# Altium project BW1097_R2M2E3.PrjPcb (part 7 of 10)

## Sheet BW1097_LEFT_OV9282.SchDoc: =project_title
size Tabloid; PageSetup: Record=PageOptions|CenterHorizontal=True|CenterVertical=True|PrintScale=0.71|XCorrection=1.00|YCorrection=1.00|PrintKind=0|BorderSize=5000000|LeftOffset=0|BottomOffset=0|Orientation=2|PaperLength=1000|PaperWidth=1000|Scale=100|PaperSource=7|PrintQuality=-4|MediaType=1|DitherType=10|PrintScaleMode=1|PaperKind=A4; CompanyName: Luxonis Holding; DrawnBy: Brian Weinstein; Organization: Luxonis Holding; Address1: 1925 Harmony Park Drive; Address2: Westminster, CO; Address3: 80234; Address4: United States; DocumentNumber: D0000196; Revision: R2M2E3; SheetNumber: 5; SheetTotal: 17
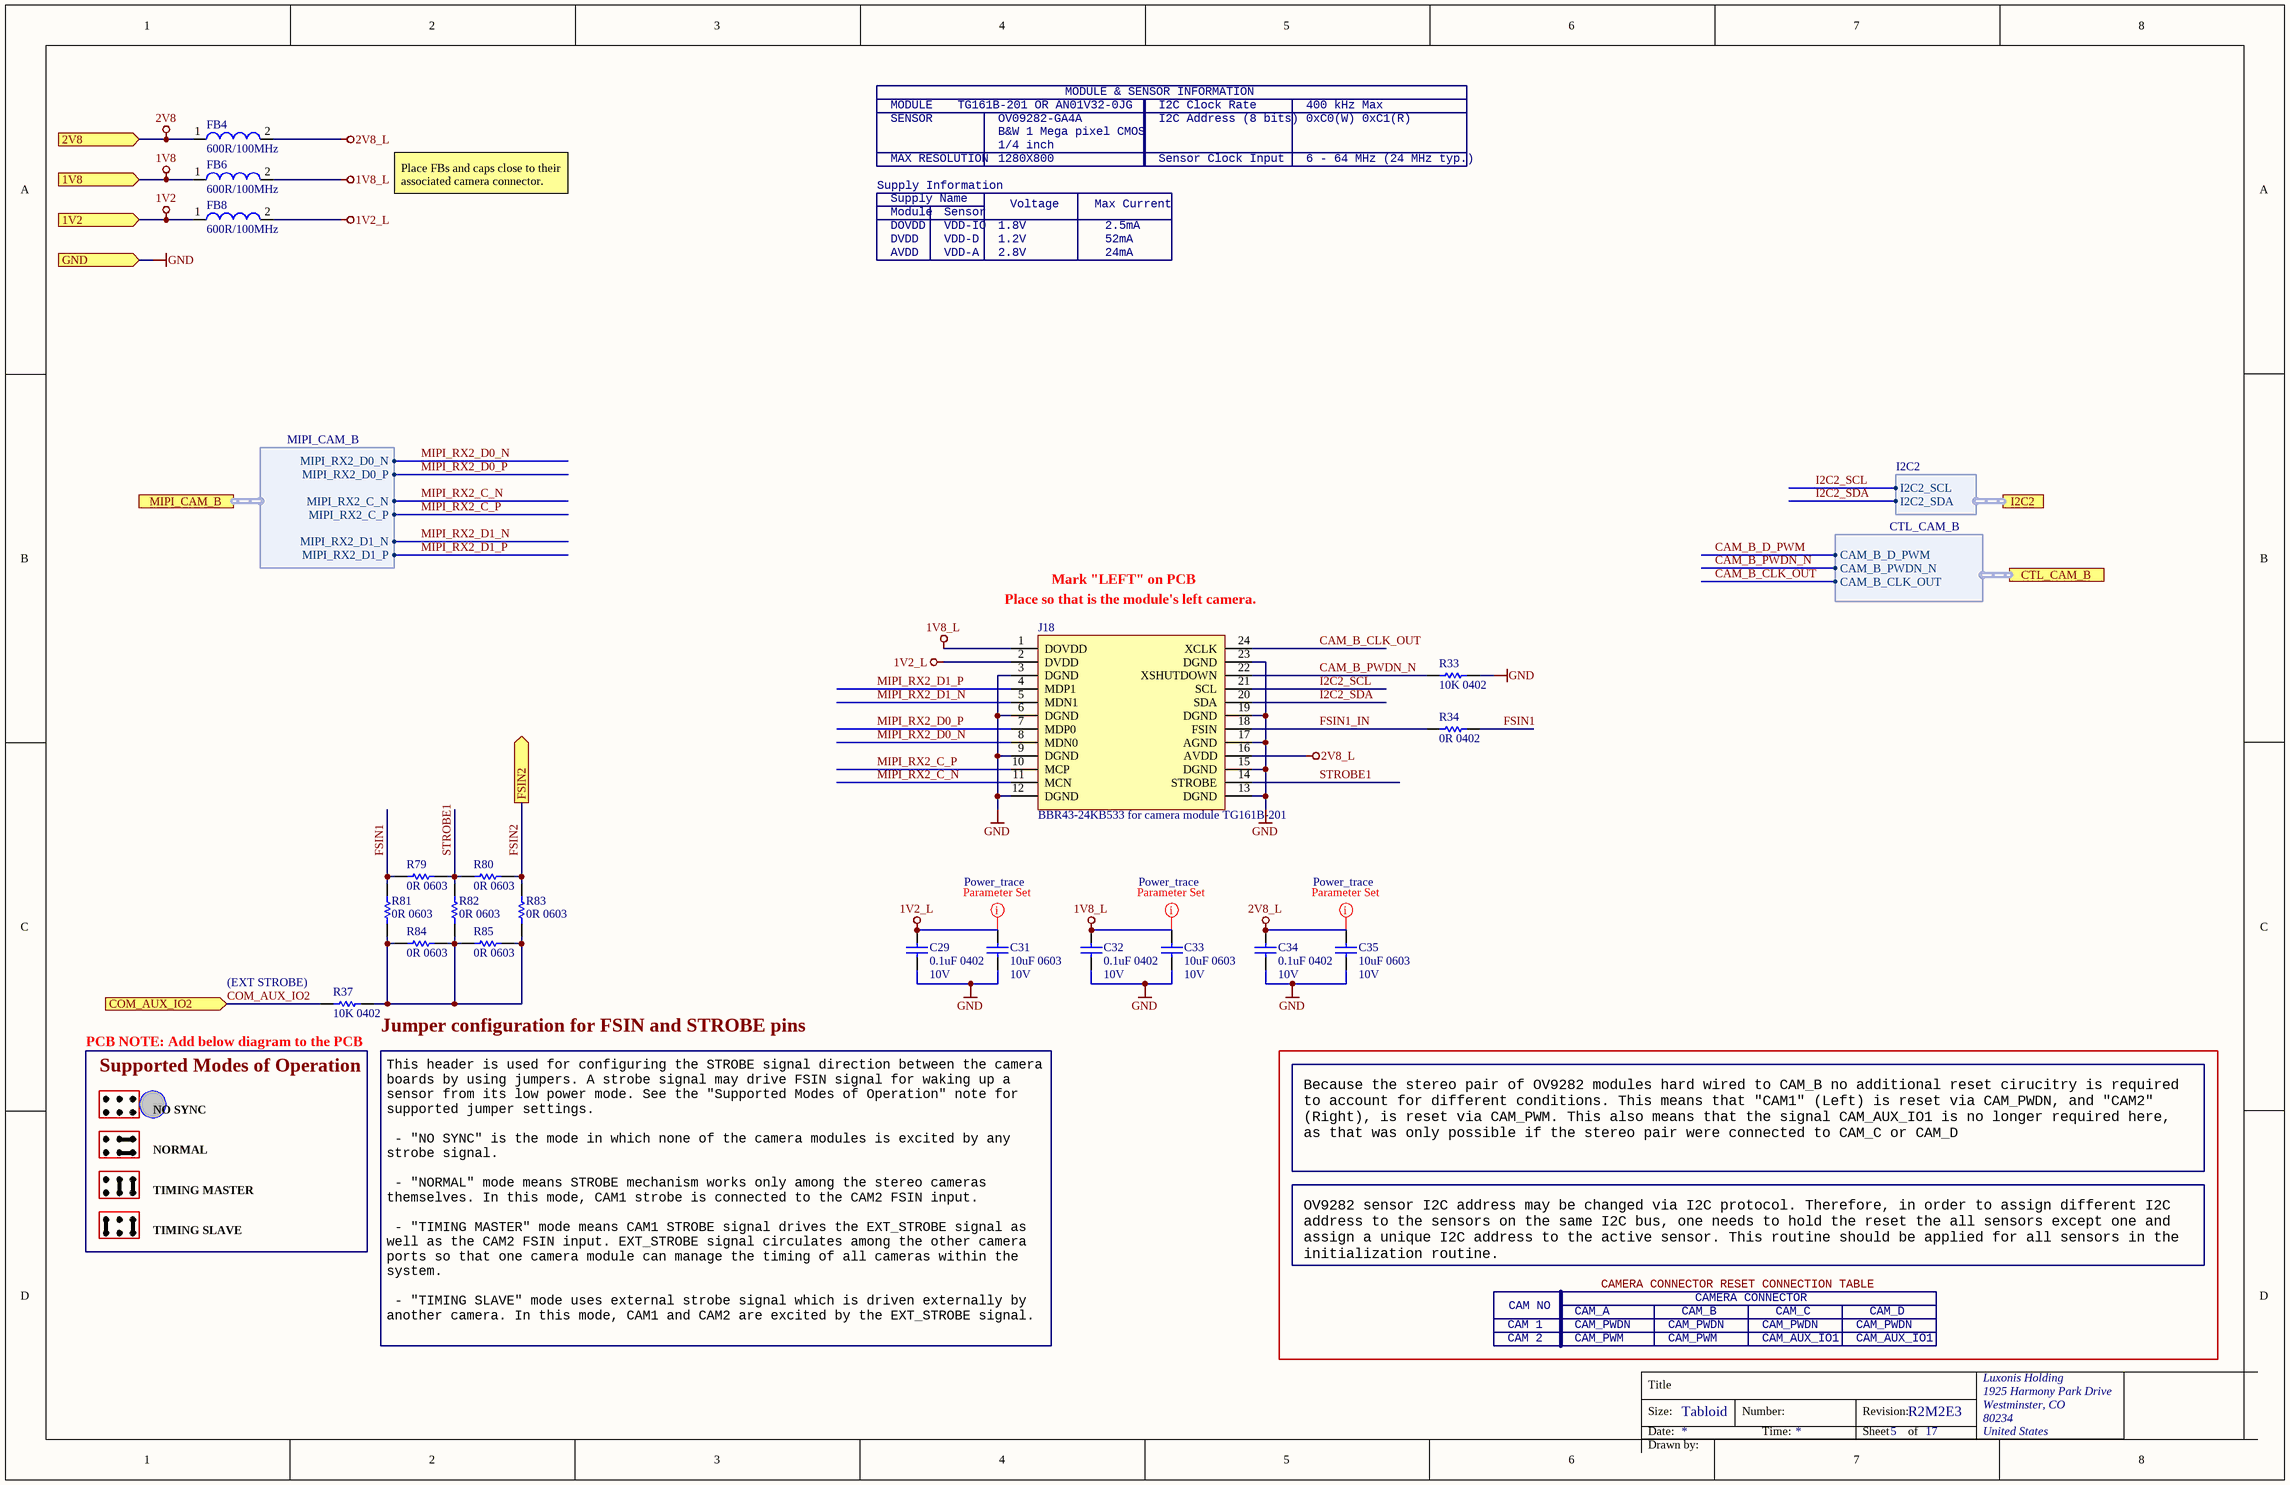
[diagram p10: BW1097_LEFT_OV9282.SchDoc]

### Parts
C29  0.1uF 0402  Voltage Rating: 10V  [CAPC0402(1005)70_N]
C31  10uF 0603  Voltage Rating: 10V  [CAPC0603(1608)100_N]
C32  0.1uF 0402  Voltage Rating: 10V  [CAPC0402(1005)70_N]
C33  10uF 0603  Voltage Rating: 10V  [CAPC0603(1608)100_N]
C34  0.1uF 0402  Voltage Rating: 10V  [CAPC0402(1005)70_N]
C35  10uF 0603  Voltage Rating: 10V  [CAPC0603(1608)100_N]
FB4  600R/100MHz  [2508056017Y2]
FB6  600R/100MHz  [2508056017Y2]
FB8  600R/100MHz  [2508056017Y2]
J18  BBR43-24KB533 for camera module TG161B-201  [TG161B-201_HD]
R33  10K 0402  [RESC0402(1005)_N]
R34  0R 0402  [RESC0402(1005)_N]
R37  10K 0402  [RESC0402(1005)_N]
R79  0R 0603  [RESC0603(1608)_N]
R80  0R 0603  [RESC0603(1608)_N]
R81  0R 0603  [RESC0603(1608)_N]
R82  0R 0603  [RESC0603(1608)_N]
R83  0R 0603  [RESC0603(1608)_N]
R84  0R 0603  [RESC0603(1608)_N]
R85  0R 0603  [RESC0603(1608)_N]

### Ports
1V2 (in), 1V8 (in), 2V8 (in), COM_AUX_IO2 (in), CTL_CAM_B (harness CTL_CAM_B), FSIN2 (out), GND (in), I2C2 (harness I2C2), MIPI_CAM_B (harness MIPI_CAM_B)

### Harnesses
I2C2: I2C2_SDA, I2C2_SCL
MIPI_CAM_B: MIPI_RX2_D1_P, MIPI_RX2_D1_N, MIPI_RX2_D0_N, MIPI_RX2_D0_P, MIPI_RX2_C_N, MIPI_RX2_C_P
CTL_CAM_B: CAM_B_CLK_OUT, CAM_B_PWDN_N, CAM_B_D_PWM

### Nets
1V2: FB8.1 ; port 1V2
1V2_L: C29.2 C31.2 FB8.2 J18.2(DVDD)
1V8: FB6.1 ; port 1V8
1V8_L: C32.2 C33.2 FB6.2 J18.1(DOVDD)
2V8: FB4.1 ; port 2V8
2V8_L: C34.2 C35.2 FB4.2 J18.16(AVDD)
GND: C29.1 C31.1 C32.1 C33.1 C34.1 C35.1 J18.3(DGND) J18.6(DGND) J18.9(DGND) J18.12(DGND) J18.13(DGND) J18.15(DGND) J18.17(AGND) J18.19(DGND) J18.23(DGND) R33.2 ; port GND
CAM_B_CLK_OUT: J18.24(XCLK) ; port CTL_CAM_B.CAM_B_CLK_OUT
CAM_B_PWDN_N: J18.22(XSHUTDOWN) R33.1 ; port CTL_CAM_B.CAM_B_PWDN_N
COM_AUX_IO2: R37.1 ; port COM_AUX_IO2
FSIN1: R34.2 R79.1 R81.2
FSIN1_IN: J18.18(FSIN) R34.1
FSIN2: R80.2 R83.2 ; port FSIN2
I2C2_SCL: J18.21(SCL) ; port I2C2.I2C2_SCL
I2C2_SDA: J18.20(SDA) ; port I2C2.I2C2_SDA
MIPI_RX2_C_N: J18.11(MCN) ; port MIPI_CAM_B.MIPI_RX2_C_N
MIPI_RX2_C_P: J18.10(MCP) ; port MIPI_CAM_B.MIPI_RX2_C_P
MIPI_RX2_D0_N: J18.8(MDN0) ; port MIPI_CAM_B.MIPI_RX2_D0_N
MIPI_RX2_D0_P: J18.7(MDP0) ; port MIPI_CAM_B.MIPI_RX2_D0_P
MIPI_RX2_D1_N: J18.5(MDN1) ; port MIPI_CAM_B.MIPI_RX2_D1_N
MIPI_RX2_D1_P: J18.4(MDP1) ; port MIPI_CAM_B.MIPI_RX2_D1_P
STROBE1: J18.14(STROBE) R79.2 R80.1 R82.2
NetR37_2: R37.2 R81.1 R82.1 R83.1 R84.1 R84.2 R85.1 R85.2

### Layout directives
net class Power_trace: 1V2_L, 1V8_L, 2V8_L

### Notes on the sheet
- MODULE & SENSOR INFORMATION
- SENSOR
- MODULE
- MAX RESOLUTION
- TG161B-201 OR AN01V32-0JG
- B&W 1 Mega pixel CMOS
- 1280X800
- OV09282-GA4A
- 1/4 inch
- I2C Address (8 bits)
- I2C Clock Rate
- Sensor Clock Input
- 400 kHz Max
- 6 - 64 MHz (24 MHz typ.)
- 0xC0(W) 0xC1(R)
- Place FBs and caps close to their associated camera connector.
- Supply Information
- DOVDD
- Supply Name
- Module
- VDD-IO
- Sensor
- 1.8V
- Voltage
- Max Current
- 2.5mA
- AVDD
- DVDD
- VDD-A
- VDD-D
- 2.8V
- 1.2V
- 24mA
- 52mA
- (near J18) Place so that is the module's left camera.
- Mark "LEFT" on PCB
- (near R37) (EXT STROBE)
- (near R37) Jumper configuration for FSIN and STROBE pins
- (near R37) PCB NOTE: Add below diagram to the PCB
- (near R37) Supported Modes of Operation
- NO SYNC
- NORMAL
- Because the stereo pair of OV9282 modules hard wired to CAM_B no additional reset cirucitry is required to account for different conditions. This means that "CAM1" (Left) is reset via CAM_PWDN, and "CAM2" (Right), is reset via CAM_PWM. This also means that the signal CAM_AUX_IO1 is no longer required here, as that was only possible if the stereo pair were connected to CAM_C or CAM_D
- TIMING MASTER
- TIMING SLAVE
- OV9282 sensor I2C address may be changed via I2C protocol. Therefore, in order to assign different I2C address to the sensors on the same I2C bus, one needs to hold the reset the all sensors except one and assign a unique I2C address to the active sensor. This routine should be applied for all sensors in the initialization routine.
- CAMERA CONNECTOR RESET CONNECTION TABLE
- CAMERA CONNECTOR
- (near R37) This header is used for configuring the STROBE signal direction between the camera boards by using jumpers. A strobe signal may drive FSIN signal for waking up a sensor from its low power mode. See the "Supported Modes of Operation" note for supported jumper settings.
  - "NO SYNC" is the mode in which none of the camera modules is excited by any strobe signal.
  - "NORMAL" mode means STROBE mechanism works only among the stereo cameras themselves. In this mode, CAM1 strobe is connected to the CAM2 FSIN input.
  - "TIMING MASTER" mode means CAM1 STROBE signal drives the EXT_STROBE signal as well as the CAM2 FSIN input. EXT_STROBE signal circulates among the other camera ports so that one camera module can manage the timing of all cameras within the system.
  - "TIMING SLAVE" mode uses external strobe signal which is driven externally by another camera. In this mode, CAM1 and CAM2 are excited by the EXT_STROBE signal.
  Note that, at most only one camera can be in the "TIMING MASTER" mode at a time. STROBE generation and FSIN reception should be configured via software.
- CAM 1
- CAM 2
- CAM NO
- CAM_A
- CAM_PWDN
- CAM_PWM
- CAM_B
- CAM_AUX_IO1
- CAM_C
- CAM_D
- Title
- Size:
- Date:
- Tabloid
- Number:
- Time:
- Revision:
- Sheet
- of
- Drawn by:

### Library data of the parts
C29 C32 C34 = GRM155R71A104JA01D: as C56 on sheet BW1097_HUB; Manufacturer Part Number 1: GRM155R71A104JA01D; Supplier 1: Digi-Key; Stock 1: 1346709; Pricing 1: 1=0.10000, 10=0.02500, 100=0.01130, 500=0.00806, 1000=0.00633, 2500=0.00575, 5000=0.00529 (USD); RoHS: Yes; Mount: Surface Mount; Case/Package: 0402; Case Code (Imperial): 0402; Case Code (Metric): 1005; Min Operating Temperature: -55°C; Max Operating Temperature: 125°C; Tolerance: 5%; Packaging: Tape and Reel; Voltage Rating (DC): 10V; Dielectric: X7R; Package Quantity: 10000; Termination: SMD/SMT; Length: 1mm; Height: 0.5mm; Width: 0.02inch; Thickness: 0.022inch; Depth: 0.5mm; Radiation Hardening: No; Lead Free: Lead Free; ComponentLink1URL: https://datasheet.ciiva.com/5411/product-5411135.pdf?src-supplier=Mouser; ComponentLink1Description: https://datasheet.ciiva.com/5411/product-5411135.pdf?src-supplier=Mouser; ComponentLink2URL: https://datasheet.ciiva.com/11618/c02e-11618821.pdf?src-supplier=Avnet; ComponentLink2Description: https://datasheet.ciiva.com/11618/c02e-11618821.pdf?src-supplier=Avnet; Supplier Part Number 1: 490-10777-1-ND
C31 C33 C35 = GRM188R61A106ME69D: as C77 on sheet BW1097_HUB; Manufacturer Part Number 1: GRM188R61A106ME69D; Supplier 1: Digi-Key; Stock 1: 2873098; Pricing 1: 1=0.21000, 10=0.14100, 100=0.07130, 500=0.04876, 1000=0.04313 (USD); RoHS: Yes; Mount: Surface Mount; Case/Package: 0603; Weight: 0.000222oz; Case Code (Metric): 1608; Case Code (Imperial): 0603; Min Operating Temperature: -55°C; Max Operating Temperature: 85°C; Packaging: Tape and Reel; Tolerance: 20%; Capacitance: 10uF; Dielectric: X5R; Voltage Rating (DC): 10V; Package Quantity: 4000; Termination: SMD/SMT; Length: 1.6mm; Height: 0.8mm; Width: 0.8mm; Thickness: 0.035inch; Depth: 0.8mm; REACH SVHC: Unknown; Lead Free: Lead Free; ComponentLink1URL: http://www.mouser.com/ds/2/281/c02e-2905.pdf?src-supplier=Mouser; ComponentLink1Description: http://www.mouser.com/ds/2/281/c02e-2905.pdf?src-supplier=Mouser; ComponentLink2URL: http://components.arrow.com/part/dataview/0323_06119472?src-supplier=Arrow+Europe; ComponentLink2Description: http://components.arrow.com/part/dataview/0323_06119472?src-supplier=Arrow+Europe; ComponentLink3URL: http://www.farnell.com/datasheets/2048014.pdf?src-supplier=Farnell; ComponentLink3Description: http://www.farnell.com/datasheets/2048014.pdf?src-supplier=Farnell; ComponentLink4URL: http://www.farnell.com/datasheets/1872210.pdf?src-supplier=Farnell; ComponentLink4Description: http://www.farnell.com/datasheets/1872210.pdf?src-supplier=Farnell; ComponentLink5URL: http://search.murata.co.jp/Ceramy/image/img/A01X/G101/ENG/GRM188R61A106ME69-01.pdf?src-supplier=Digi-Key; ComponentLink5Description: http://search.murata.co.jp/Ceramy/image/img/A01X/G101/ENG/GRM188R61A106ME69-01.pdf?src-supplier=Digi-Key; ComponentLink6URL: http://www.farnell.com/datasheets/1872210.pdf?src-supplier=Newark; ComponentLink6Description: http://www.farnell.com/datasheets/1872210.pdf?src-supplier=Newark; ComponentLink7URL: http://www.farnell.com/datasheets/2048014.pdf?src-supplier=Element14; ComponentLink7Description: http://www.farnell.com/datasheets/2048014.pdf?src-supplier=Element14; ComponentLink8URL: http://www.farnell.com/datasheets/2048014.pdf?src-supplier=Newark; ComponentLink8Description: http://www.farnell.com/datasheets/2048014.pdf?src-supplier=Newark; Supplier Part Number 1: 490-10475-1-ND
FB4 FB6 FB8 = 2508056017Y2: FERRITE BEAD, 0.1OHM, 2A, 0805, 600R/100MHz; Manufacturer 1: Fair-Rite; Impedance: 600R; Tolerance: 25%; Resistance: 350mR; DC Resistance (DCR): 100mR; Test Frequency: 100MHz; Manufacturer Part Number 1: 2508056017Y2; Supplier 1: Digi-Key; Stock 1: 100491; Pricing 1: 1=0.10000, 10=0.07900, 25=0.07120, 50=0.05240, 100=0.04520, 250=0.03568, 500=0.03014, 1000=0.02538 (USD); RoHS: Yes; Case/Package: 0805; Number of Pins: 2; Case Code (Metric): 2012; Case Code (Imperial): 0805; Min Operating Temperature: -55°C; Max Operating Temperature: 125°C; Package Quantity: 4000; Packaging: Tape and Reel; Max DC Current: 2A; Termination: SMD/SMT; Military Standard: Not; DC Current: 2A; Current Rating: 2A; Frequency: 100MHz; Length: 2mm; Height: 0.9mm; Width: 1.25mm; Depth: 1.25mm; Radiation Hardening: No; REACH SVHC: No SVHC; ComponentLink1URL: https://datasheet.ciiva.com/3854/3802508056017y2-3854245.pdf?src-supplier=Arrow; ComponentLink1Description: https://datasheet.ciiva.com/3854/3802508056017y2-3854245.pdf?src-supplier=Arrow; ComponentLink2URL: https://datasheet.ciiva.com/22735/652149-22735047.pdf?src-supplier=Element14; ComponentLink2Description: https://datasheet.ciiva.com/22735/652149-22735047.pdf?src-supplier=Element14; ComponentLink3URL: https://datasheet.ciiva.com/1127/26143-1127514.pdf?src-supplier=Farnell; ComponentLink3Description: https://datasheet.ciiva.com/1127/26143-1127514.pdf?src-supplier=Farnell; ComponentLink4URL: https://datasheet.ciiva.com/18090/getdatasheetpartid-212640-18090187.pdf?src-supplier=Verical; ComponentLink4Description: https://datasheet.ciiva.com/18090/getdatasheetpartid-212640-18090187.pdf?src-supplier=Verical; ComponentLink5URL: https://datasheet.ciiva.com/7620/26143-7620140.pdf?src-supplier=Element14; ComponentLink5Description: https://datasheet.ciiva.com/7620/26143-7620140.pdf?src-supplier=Element14; Supplier Part Number 1: 1934-1487-1-ND
J18 = TG161B-201_Connector: CONN 24 way, 2 row board to board connector SMD; Manufacturer: ACON; Manufacturer PN: BBR43-24KB533
R33 R37 = RC0402FR-1310KL: as R40 on sheet BW1097_HUB; Manufacturer Part Number 1: RC0402FR-1310KL; ComponentLink1URL: https://datasheet.ciiva.com/16940/pyu-rc0402-51-rohs-l-6-16940293.pdf?src-supplier=Avnet+Europe; ComponentLink1Description: https://datasheet.ciiva.com/16940/pyu-rc0402-51-rohs-l-6-16940293.pdf?src-supplier=Avnet+Europe; ComponentLink2URL: https://datasheet.ciiva.com/28386/pyu-rc0402-51-rohs-l-6-28386855.pdf?src-supplier=Avnet+Europe; ComponentLink2Description: https://datasheet.ciiva.com/28386/pyu-rc0402-51-rohs-l-6-28386855.pdf?src-supplier=Avnet+Europe; ComponentLink3URL: https://datasheet.ciiva.com/16740/pyu-rc0402-51-rohs-l-6-r-16740602.pdf?src-supplier=Future+Electronics; ComponentLink3Description: https://datasheet.ciiva.com/16740/pyu-rc0402-51-rohs-l-6-r-16740602.pdf?src-supplier=Future+Electronics; ComponentLink4URL: https://datasheet.ciiva.com/8891/pyu-rc0402-51-rohs-l-6-8891339.pdf?src-supplier=Avnet; ComponentLink4Description: https://datasheet.ciiva.com/8891/pyu-rc0402-51-rohs-l-6-8891339.pdf?src-supplier=Avnet; ComponentLink5URL: https://datasheet.ciiva.com/5557/pyu-rc0402-51-rohs-l-6-r-5557997.pdf?src-supplier=Mouser; ComponentLink5Description: https://datasheet.ciiva.com/5557/pyu-rc0402-51-rohs-l-6-r-5557997.pdf?src-supplier=Mouser; ComponentLink6URL: https://datasheet.ciiva.com/7983/1018594-7983533.pdf?src-supplier=Element14; ComponentLink6Description: https://datasheet.ciiva.com/7983/1018594-7983533.pdf?src-supplier=Element14; Supplier 1: Newark; Stock 1: 62239; Pricing 1: 1=0.10000, 25=0.01200, 100=0.00400, 250=0.00400, 500=0.00300, 1000=0.00300 (USD); RoHS: Yes; Case/Package: 0402; Number of Pins: 2; Contact Plating: Tin,Matte,Lead; Case Code (Imperial): 0402; Case Code (Metric): 1005; Min Operating Temperature: -55°C; Max Operating Temperature: 155°C; Tolerance: 1%; Composition: Thick Film; Packaging: Tape and Reel; Termination: SMD/SMT; Military Standard: Not; Voltage Rating (DC): 50V; Working Voltage: 50V; Number of Terminations: 2; Length: 1mm; Depth: 0.5mm; Radiation Hardening: No; REACH SVHC: No SVHC; Lead Free: Lead Free; Supplier Part Number 1: 67R9960; Supplier 2: Future Electronics; Supplier 3: Mouser; Supplier 4: Element14; Supplier Part Number 2: RC0402FR-1310KL-CUTT; Supplier Part Number 3: 603-RC0402FR-1310KL; Supplier Part Number 4: 1799235
R34 = CRCW04020000Z0ED: as R41 on sheet BW1097_HUB; Manufacturer Part Number 1: CRCW04020000Z0ED; Supplier 1: Digi-Key; Stock 1: 855968; Pricing 1: 1=0.10000, 10=0.03400, 25=0.02440, 50=0.01860, 100=0.01380, 250=0.01048, 500=0.00840, 1000=0.00618, 5000=0.00443 (USD); RoHS: Yes; Mount: Surface Mount; Case/Package: 0402; Weight: 2.3E-05oz; Case Code (Imperial): 0402; Case Code (Metric): 1005; Contact Plating: Tin; Min Operating Temperature: -55°C; Max Operating Temperature: 155°C; Packaging: Tape and Reel; Composition: Thick Film; Voltage Rating (DC): 50V; Package Quantity: 1; Termination: SMD/SMT; Number of Terminations: 2; Military Standard: Not; Max Power Dissipation: 63mW; Features: Automotive AEC-Q200; Length: 1mm; Height: 0.35mm; Width: 0.5mm; Depth: 0.5mm; Radiation Hardening: No; REACH SVHC: Unknown; Lead Free: Lead Free; ComponentLink1URL: https://datasheet.ciiva.com/3255/dcrcwe3-3255944.pdf?src-supplier=Avnet; ComponentLink1Description: https://datasheet.ciiva.com/3255/dcrcwe3-3255944.pdf?src-supplier=Avnet; ComponentLink2URL: https://datasheet.ciiva.com/3255/dcrcwe3-3255945.pdf?src-supplier=Avnet; ComponentLink2Description: https://datasheet.ciiva.com/3255/dcrcwe3-3255945.pdf?src-supplier=Avnet; ComponentLink3URL: https://datasheet.ciiva.com/16881/dcrcwe3-16881413.pdf?src-supplier=Avnet+Europe; ComponentLink3Description: https://datasheet.ciiva.com/16881/dcrcwe3-16881413.pdf?src-supplier=Avnet+Europe; ComponentLink4URL: https://datasheet.ciiva.com/2461/dcrcwe3-2461962.pdf?src-supplier=Digi-Key; ComponentLink4Description: https://datasheet.ciiva.com/2461/dcrcwe3-2461962.pdf?src-supplier=Digi-Key; ComponentLink5URL: https://datasheet.ciiva.com/7841/1720486-7841802.pdf?src-supplier=Element14; ComponentLink5Description: https://datasheet.ciiva.com/7841/1720486-7841802.pdf?src-supplier=Element14; ComponentLink6URL: https://datasheet.ciiva.com/2461/dcrcwe3-2461963.pdf?src-supplier=Digi-Key; ComponentLink6Description: https://datasheet.ciiva.com/2461/dcrcwe3-2461963.pdf?src-supplier=Digi-Key; ComponentLink7URL: https://datasheet.ciiva.com/2461/dcrcwe3-2461964.pdf?src-supplier=Digi-Key; ComponentLink7Description: https://datasheet.ciiva.com/2461/dcrcwe3-2461964.pdf?src-supplier=Digi-Key; ComponentLink8URL: https://datasheet.ciiva.com/7841/1697337-7841468.pdf?src-supplier=Element14; ComponentLink8Description: https://datasheet.ciiva.com/7841/1697337-7841468.pdf?src-supplier=Element14; ComponentLink9URL: https://datasheet.ciiva.com/16761/70200976-16761309.pdf?src-supplier=Allied+Electronics; ComponentLink9Description: https://datasheet.ciiva.com/16761/70200976-16761309.pdf?src-supplier=Allied+Electronics; ComponentLink10URL: https://datasheet.ciiva.com/26311/fld-crcw-e3-data-en-26311550.pdf?src-supplier=Distrelec; ComponentLink10Description: https://datasheet.ciiva.com/26311/fld-crcw-e3-data-en-26311550.pdf?src-supplier=Distrelec; Supplier Part Number 1: 541-0.0JCT-ND
R79-R85 = CRCW06030000Z0EA: as R22 on sheet BW1097_EthernetSchDoc; Supplier 1: Digi-Key; Stock 1: 742743; Pricing 1: 1=0.100000, 10=0.034000, 25=0.024400, 50=0.018600, 100=0.013800, 250=0.010480, 500=0.008400, 1000=0.006180 (USD); RoHS: Yes; Mount: Surface Mount; Case/Package: 0603; Weight: 7.1E-05oz; Contact Plating: Tin,Lead; Case Code (Metric): 1608; Case Code (Imperial): 0603; Min Operating Temperature: -55°C; Max Operating Temperature: 155°C; Composition: Thick Film; Termination: SMD/SMT; Packaging: Tape and Reel; Package Quantity: 1; Number of Terminations: 2; Military Standard: Not; Max Power Dissipation: 100mW; Voltage Rating (DC): 75V; Features: Automotive AEC-Q200; Working Voltage: 75V; Length: 1.55mm; Height: 0.02inch; Width: 0.033inch; Depth: 0.85mm; Radiation Hardening: No; Lead Free: Lead Free; REACH SVHC: Unknown; ComponentLink1URL: https://datasheet.ciiva.com/2461/dcrcwe3-2461968.pdf?src-supplier=Digi-Key; ComponentLink1Description: https://datasheet.ciiva.com/2461/dcrcwe3-2461968.pdf?src-supplier=Digi-Key; ComponentLink2URL: https://datasheet.ciiva.com/2461/dcrcwe3-2461969.pdf?src-supplier=Digi-Key; ComponentLink2Description: https://datasheet.ciiva.com/2461/dcrcwe3-2461969.pdf?src-supplier=Digi-Key; ComponentLink3URL: https://datasheet.ciiva.com/2461/dcrcwe3-2461970.pdf?src-supplier=Digi-Key; ComponentLink3Description: https://datasheet.ciiva.com/2461/dcrcwe3-2461970.pdf?src-supplier=Digi-Key; ComponentLink4URL: https://datasheet.ciiva.com/8340/dcrcwe3-8340197.pdf?src-supplier=Avnet; ComponentLink4Description: https://datasheet.ciiva.com/8340/dcrcwe3-8340197.pdf?src-supplier=Avnet; ComponentLink5URL: https://datasheet.ciiva.com/16941/dcrcw-16941302.pdf?src-supplier=Avnet+Europe; ComponentLink5Description: https://datasheet.ciiva.com/16941/dcrcw-16941302.pdf?src-supplier=Avnet+Europe; ComponentLink6URL: https://datasheet.ciiva.com/16199/dcrcwe3-16199063.pdf?src-supplier=Future+Electronics; ComponentLink6Description: https://datasheet.ciiva.com/16199/dcrcwe3-16199063.pdf?src-supplier=Future+Electronics; ComponentLink7URL: https://datasheet.ciiva.com/16725/70201119-16725175.pdf?src-supplier=Allied+Electronics; ComponentLink7Description: https://datasheet.ciiva.com/16725/70201119-16725175.pdf?src-supplier=Allied+Electronics; ComponentLink8URL: https://datasheet.ciiva.com/26316/fld-crcw-e3-data-en-26316615.pdf?src-supplier=Distrelec; ComponentLink8Description: https://datasheet.ciiva.com/26316/fld-crcw-e3-data-en-26316615.pdf?src-supplier=Distrelec; ComponentLink9URL: https://datasheet.ciiva.com/5544/dcrcwe3-109170-5544344.pdf?src-supplier=Mouser; ComponentLink9Description: https://datasheet.ciiva.com/5544/dcrcwe3-109170-5544344.pdf?src-supplier=Mouser; ComponentLink10URL: https://datasheet.ciiva.com/7841/1720486-7841816.pdf?src-supplier=Element14; ComponentLink10Description: https://datasheet.ciiva.com/7841/1720486-7841816.pdf?src-supplier=Element14; ComponentLink11URL: https://datasheet.ciiva.com/7841/1720486-7841817.pdf?src-supplier=Element14; ComponentLink11Description: https://datasheet.ciiva.com/7841/1720486-7841817.pdf?src-supplier=Element14; ComponentLink12URL: https://datasheet.ciiva.com/7841/125364-7841818.pdf?src-supplier=Element14; ComponentLink12Description: https://datasheet.ciiva.com/7841/125364-7841818.pdf?src-supplier=Element14; ComponentLink13URL: https://datasheet.ciiva.com/16721/70201119-16721450.pdf?src-supplier=Allied+Electronics; ComponentLink13Description: https://datasheet.ciiva.com/16721/70201119-16721450.pdf?src-supplier=Allied+Electronics; Supplier Part Number 1: 541-0.0GCT-ND

## Sheet BW1097_Power_Supply.SchDoc: =project_title
size Tabloid; PageSetup: Record=PageOptions|CenterHorizontal=True|CenterVertical=True|PrintScale=0.73|XCorrection=1.00|YCorrection=1.00|PrintKind=0|BorderSize=5000000|LeftOffset=0|BottomOffset=0|Orientation=2|PaperLength=1000|PaperWidth=1000|Scale=100|PaperSource=7|PrintQuality=-4|MediaType=1|DitherType=10|PaperKind=A4|PrintScaleMode=1; CompanyName: Luxonis Holding; DrawnBy: Brian Weinstein; Organization: Luxonis Holding; Address1: 1925 Harmony Park Drive; Address2: Westminster, CO; Address3: 80234; Address4: United States; DocumentNumber: D0000196; Revision: R2M2E3; SheetNumber: 7; SheetTotal: 17
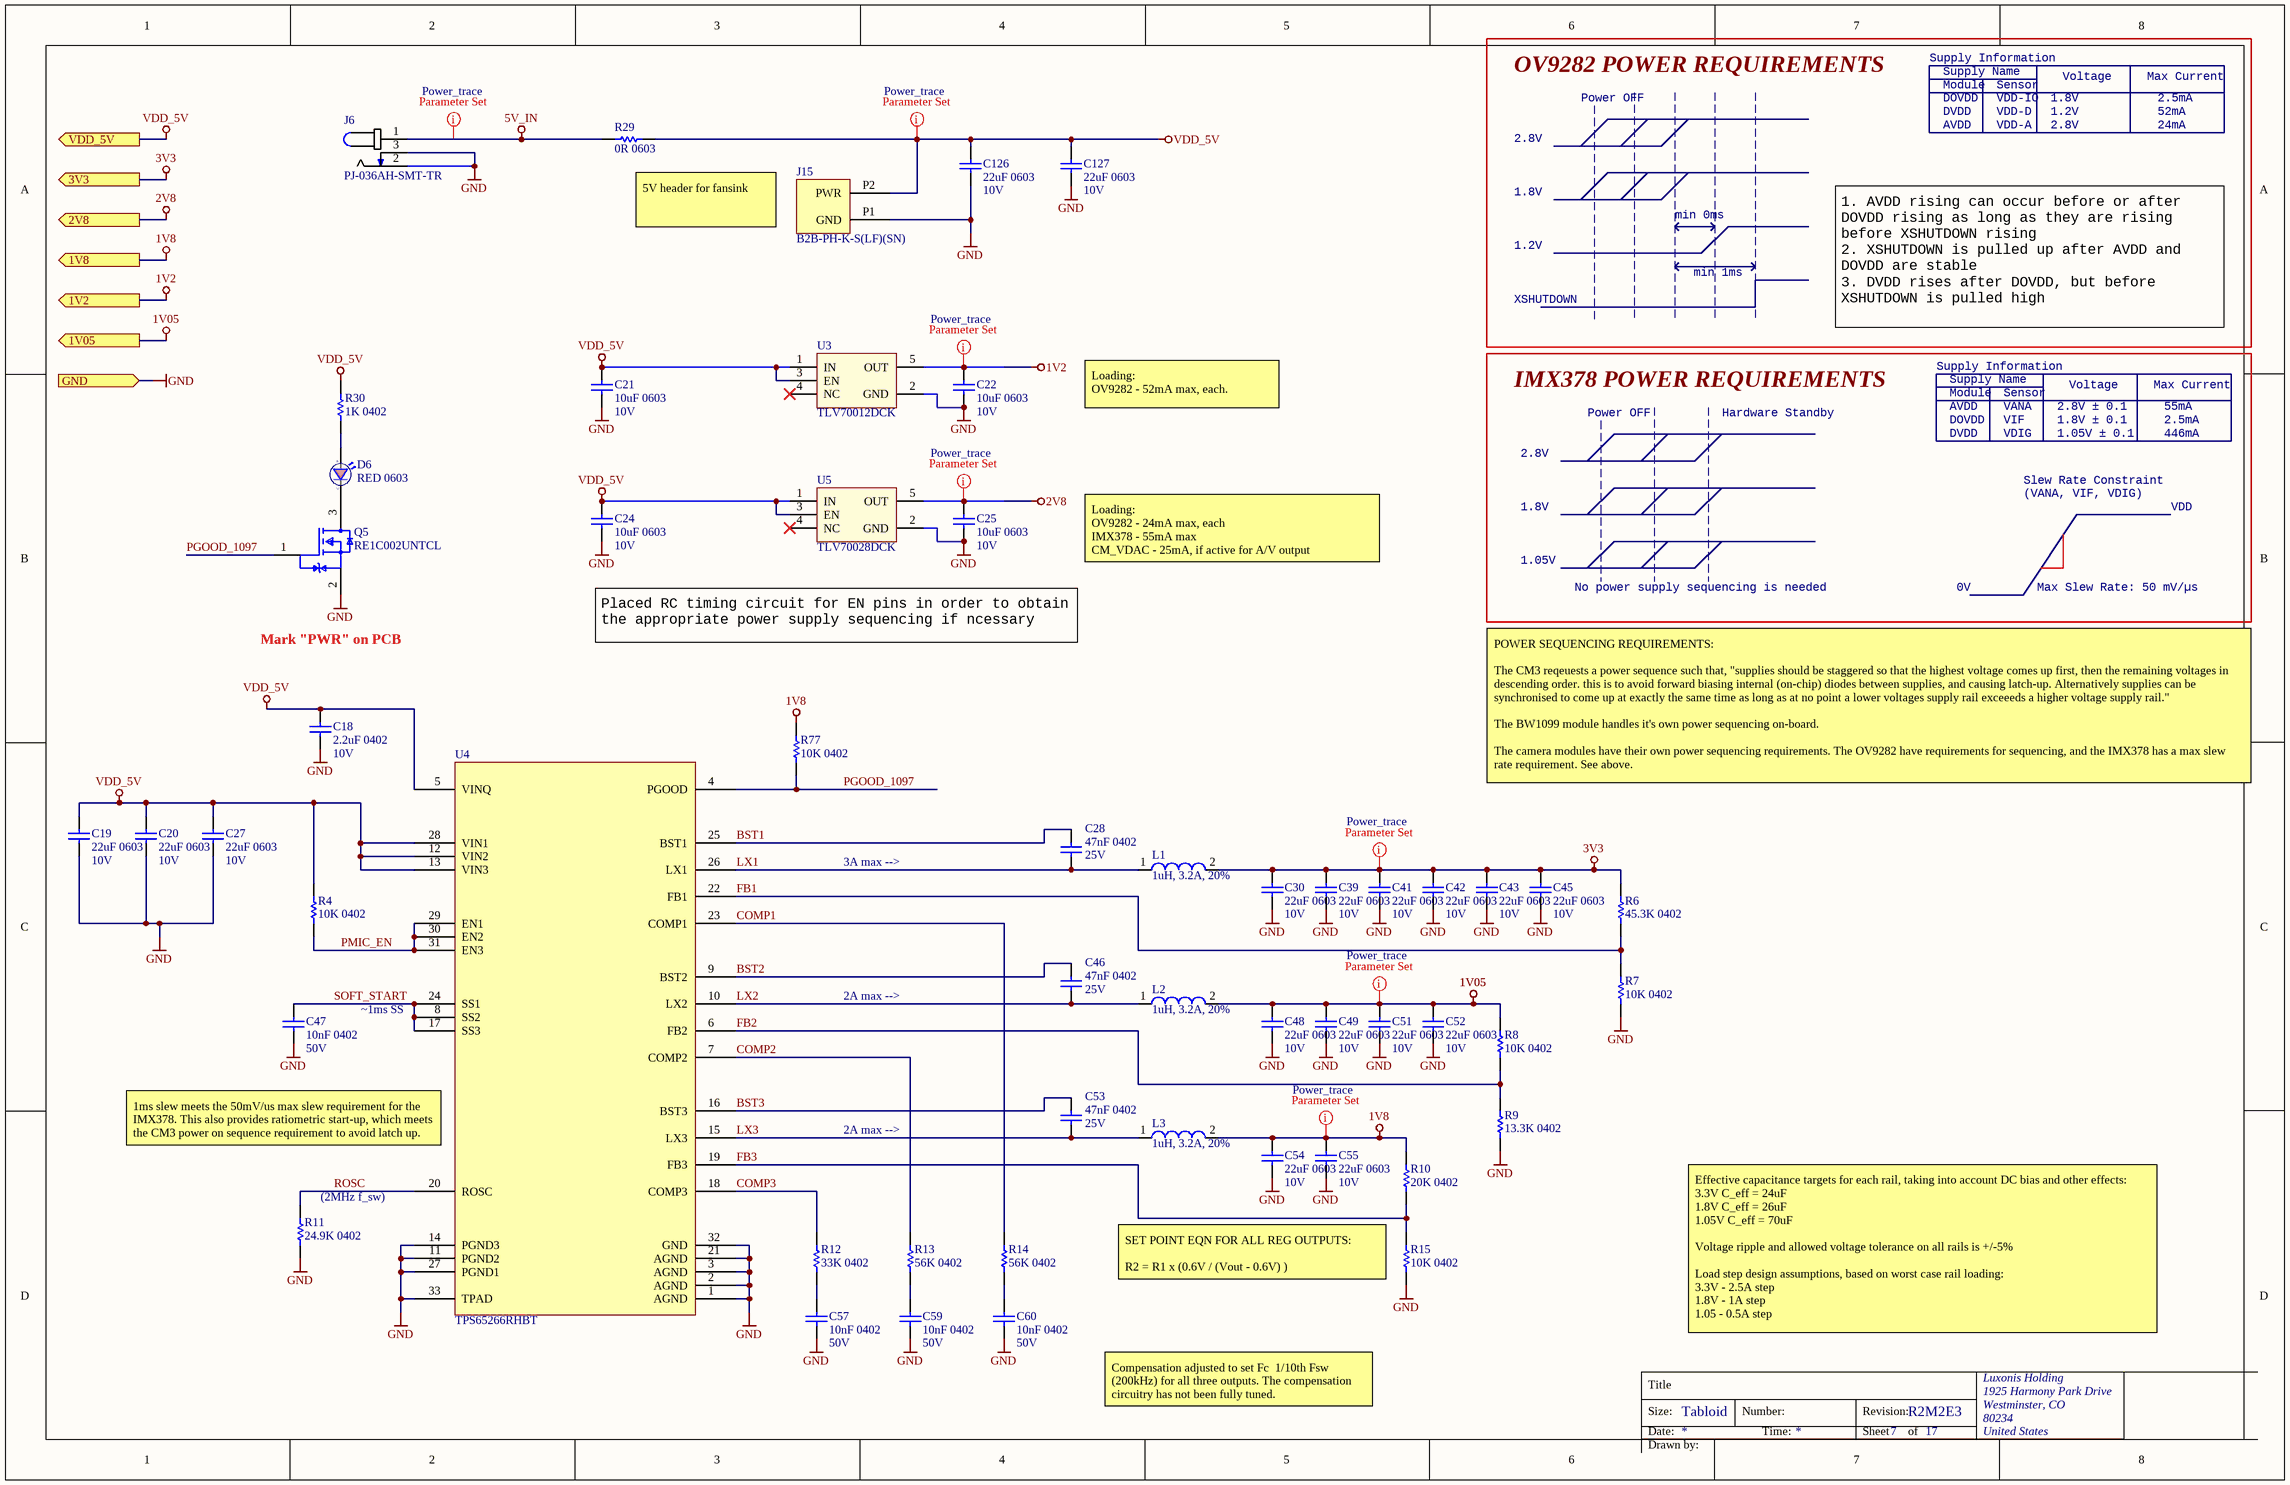
[diagram p11: BW1097_Power_Supply.SchDoc]

### Parts
C18  2.2uF 0402  Voltage Rating: 10V  [CAPC0402(1005)70_N]
C19  22uF 0603  Voltage Rating: 10V  [CAPC0603(1608)100_N]
C20  22uF 0603  Voltage Rating: 10V  [CAPC0603(1608)100_N]
C21  10uF 0603  Voltage Rating: 10V  [CAPC0603(1608)100_N]
C22  10uF 0603  Voltage Rating: 10V  [CAPC0603(1608)100_N]
C24  10uF 0603  Voltage Rating: 10V  [CAPC0603(1608)100_N]
C25  10uF 0603  Voltage Rating: 10V  [CAPC0603(1608)100_N]
C27  22uF 0603  Voltage Rating: 10V  [CAPC0603(1608)100_N]
C28  47nF 0402  Voltage: 25V  [CAPC0402(1005)70_N]
C30  22uF 0603  Voltage Rating: 10V  [CAPC0603(1608)100_N]
C39  22uF 0603  Voltage Rating: 10V  [CAPC0603(1608)100_N]
C41  22uF 0603  Voltage Rating: 10V  [CAPC0603(1608)100_N]
C42  22uF 0603  Voltage Rating: 10V  [CAPC0603(1608)100_N]
C43  22uF 0603  Voltage Rating: 10V  [CAPC0603(1608)100_N]
C45  22uF 0603  Voltage Rating: 10V  [CAPC0603(1608)100_N]
C46  47nF 0402  Voltage: 25V  [CAPC0402(1005)70_N]
C47  10nF 0402  Voltage Rating: 50V  [CAPC0402(1005)60_N]
C48  22uF 0603  Voltage Rating: 10V  [CAPC0603(1608)100_N]
C49  22uF 0603  Voltage Rating: 10V  [CAPC0603(1608)100_N]
C51  22uF 0603  Voltage Rating: 10V  [CAPC0603(1608)100_N]
C52  22uF 0603  Voltage Rating: 10V  [CAPC0603(1608)100_N]
C53  47nF 0402  Voltage: 25V  [CAPC0402(1005)70_N]
C54  22uF 0603  Voltage Rating: 10V  [CAPC0603(1608)100_N]
C55  22uF 0603  Voltage Rating: 10V  [CAPC0603(1608)100_N]
C57  10nF 0402  Voltage Rating: 50V  [CAPC0402(1005)60_N]
C59  10nF 0402  Voltage Rating: 50V  [CAPC0402(1005)60_N]
C60  10nF 0402  Voltage Rating: 50V  [CAPC0402(1005)60_N]
C126  22uF 0603  Voltage Rating: 10V  [CAPC0603(1608)100_N]
C127  22uF 0603  Voltage Rating: 10V  [CAPC0603(1608)100_N]
D6  RED 0603  [SML_D1xx8W]
J6  PJ-036AH-SMT-TR  [PJ-036AH-SMT]
J15  B2B-PH-K-S(LF)(SN)  [B2B-PH-K-S(LF)(SN)]
L1  1uH, 3.2A, 20%  [DFE252012P-1R0M=P2]
L2  1uH, 3.2A, 20%  [DFE252012P-1R0M=P2]
L3  1uH, 3.2A, 20%  [DFE252012P-1R0M=P2]
Q5  RE1C002UNTCL  [RE1C002UNTCL]
R4  10K 0402  [RESC0402(1005)_N]
R6  45.3K 0402  [RESC0402(1005)_N]
R7  10K 0402  [RESC0402(1005)_N]
R8  10K 0402  [RESC0402(1005)_N]
R9  13.3K 0402  [RESC0402(1005)_N]
R10  20K 0402  [RESC0402(1005)_N]
R11  24.9K 0402  [RESC0402(1005)_N]
R12  33K 0402  [RESC0402(1005)_N]
R13  56K 0402  [RESC0402(1005)_N]
R14  56K 0402  [RESC0402(1005)_N]
R15  10K 0402  [RESC0402(1005)_N]
R29  0R 0603  [RESC0603(1608)_N]
R30  1K 0402  [RESC0402(1005)_N]
R77  10K 0402  [RESC0402(1005)_N]
U3  TLV70012DCK  [TLV70012DCK]
U4  TPS65266RHBT  [TPS65266RHBT]
U5  TLV70028DCK  [TLV70028DCK]

### Ports
1V2 (out), 1V05 (out), 1V8 (out), 2V8 (out), 3V3 (out), GND (in), VDD_5V (out)

### Nets
1V2: C22.2 U3.5(OUT) ; port 1V2
1V05: C48.1 C49.1 C51.1 C52.1 L2.2 R8.2 ; port 1V05
1V8: C54.1 C55.1 L3.2 R10.2 R77.2 ; port 1V8
2V8: C25.2 U5.5(OUT) ; port 2V8
3V3: C30.1 C39.1 C41.1 C42.1 C43.1 C45.1 L1.2 R6.2 ; port 3V3
5V_IN: J6.1 R29.2
GND: C18.2 C19.2 C20.2 C21.1 C22.1 C24.1 C25.1 C27.2 C30.2 C39.2 C41.2 C42.2 C43.2 C45.2 C47.2 C48.2 C49.2 C51.2 C52.2 C54.2 C55.2 C57.2 C59.2 C60.2 C126.2 C127.2 J6.2 J6.3 J15.P1(GND) Q5.2(Source) R7.1 R9.1 R11.1 R15.1 U3.2(GND) U4.1(AGND) U4.2(AGND) U4.3(AGND) U4.11(PGND2) U4.14(PGND3) U4.21(AGND) U4.27(PGND1) U4.32(GND) U4.33(TPAD) U5.2(GND) ; port GND
VDD_5V: C18.1 C19.1 C20.1 C21.2 C24.2 C27.1 C126.1 C127.1 J15.P2(PWR) R4.2 R29.1 R30.2 U3.1(IN) U3.3(EN) U4.5(VINQ) U4.12(VIN2) U4.13(VIN3) U4.28(VIN1) U5.1(IN) U5.3(EN) ; port VDD_5V
BST1: C28.1 U4.25(BST1)
BST2: C46.1 U4.9(BST2)
BST3: C53.1 U4.16(BST3)
COMP1: R14.2 U4.23(COMP1)
COMP2: R13.2 U4.7(COMP2)
COMP3: R12.2 U4.18(COMP3)
FB1: R6.1 R7.2 U4.22(FB1)
FB2: R8.1 R9.2 U4.6(FB2)
FB3: R10.1 R15.2 U4.19(FB3)
LX1: C28.2 L1.1 U4.26(LX1)
LX2: C46.2 L2.1 U4.10(LX2)
LX3: C53.2 L3.1 U4.15(LX3)
PGOOD_1097: Q5.1(Gate) R77.1 U4.4(PGOOD)
PMIC_EN: R4.1 U4.29(EN1) U4.30(EN2) U4.31(EN3)
ROSC: R11.2 U4.20(ROSC)
SOFT_START: C47.1 U4.8(SS2) U4.17(SS3) U4.24(SS1)
NetC57_1: C57.1 R12.1
NetC59_1: C59.1 R13.1
NetC60_1: C60.1 R14.1
NetD6_1: D6.1(C) Q5.3(Drain)
NetD6_2: D6.2(A) R30.1

Not connected (* = marked no-connect by the designer): U3 4(NC)*; U5 4(NC)*

### Layout directives
net class Power_trace: 1V2, 1V05, 1V8, 2V8, 3V3, 5V_IN, VDD_5V

### Notes on the sheet
- OV9282 POWER REQUIREMENTS
- Supply Information
- Supply Name
- Module
- Sensor
- Voltage
- Max Current
- 2.8V
- Power OFF
- AVDD
- DOVDD
- DVDD
- VDD-A
- VDD-IO
- VDD-D
- 1.8V
- 1.2V
- 24mA
- 2.5mA
- 52mA
- (near R29) 5V header for fansink
- min 0ms
- XSHUTDOWN
- min 1ms
- 1. AVDD rising can occur before or after DOVDD rising as long as they are rising before XSHUTDOWN rising
  2. XSHUTDOWN is pulled up after AVDD and DOVDD are stable
  3. DVDD rises after DOVDD, but before XSHUTDOWN is pulled high
- Loading:
  OV9282 - 52mA max, each.
- IMX378 POWER REQUIREMENTS
- Hardware Standby
- VANA
- VIF
- VDIG
- 2.8V ± 0.1
- 1.8V ± 0.1
- 1.05V ± 0.1
- 55mA
- 446mA
- Slew Rate Constraint
- (VANA, VIF, VDIG)
- Loading:
  OV9282 - 24mA max, each
  IMX378 - 55mA max
  CM_VDAC - 25mA, if active for A/V output
- 1.05V
- VDD
- No power supply sequencing is needed
- 0V
- Max Slew Rate: 50 mV/µs
- Mark "PWR" on PCB
- Placed RC timing circuit for EN pins in order to obtain the appropriate power supply sequencing if ncessary
- POWER SEQUENCING REQUIREMENTS:
  The CM3 reqeuests a power sequence such that, "supplies should be staggered so that the highest voltage comes up first, then the remaining voltages in descending order. this is to avoid forward biasing internal (on-chip) diodes between supplies, and causing latch-up. Alternatively supplies can be synchronised to come up at exactly the same time as long as at no point a lower voltages supply rail exceeeds a higher voltage supply rail."
  The BW1099 module handles it's own power sequencing on-board.
  The camera modules have their own power sequencing requirements. The OV9282 have requirements for sequencing, and the IMX378 has a max slew rate requirement. See above.
- 3A max -->
- ~1ms SS
- 2A max -->
- (near U4) 1ms slew meets the 50mV/us max slew requirement for the IMX378. This also provides ratiometric start-up, which meets the CM3 power on sequence requirement to avoid latch up.
- (near R11) (2MHz f_sw)
- (near R15) SET POINT EQN FOR ALL REG OUTPUTS:
  R2 = R1 x (0.6V / (Vout - 0.6V) )
- Effective capacitance targets for each rail, taking into account DC bias and other effects:
  3.3V C_eff = 24uF
  1.8V C_eff = 26uF
  1.05V C_eff = 70uF
  Voltage ripple and allowed voltage tolerance on all rails is +/-5%
  Load step design assumptions, based on worst case rail loading:
  3.3V - 2.5A step
  1.8V - 1A step
  1.05 - 0.5A step
- Compensation adjusted to set Fc  1/10th Fsw  (200kHz) for all three outputs. The compensation circuitry has not been fully tuned.
- Title
- Size:
- Date:
- Tabloid
- Number:
- Time:
- Revision:
- Sheet
- of
- Drawn by: